# EAGLE design Adafruit-FONA-800-GSM-Breakout (EAGLE 6.4)
COMPANY: ADAFRUIT INDUSTRIES; DRAWN: KTOWN; REV: C
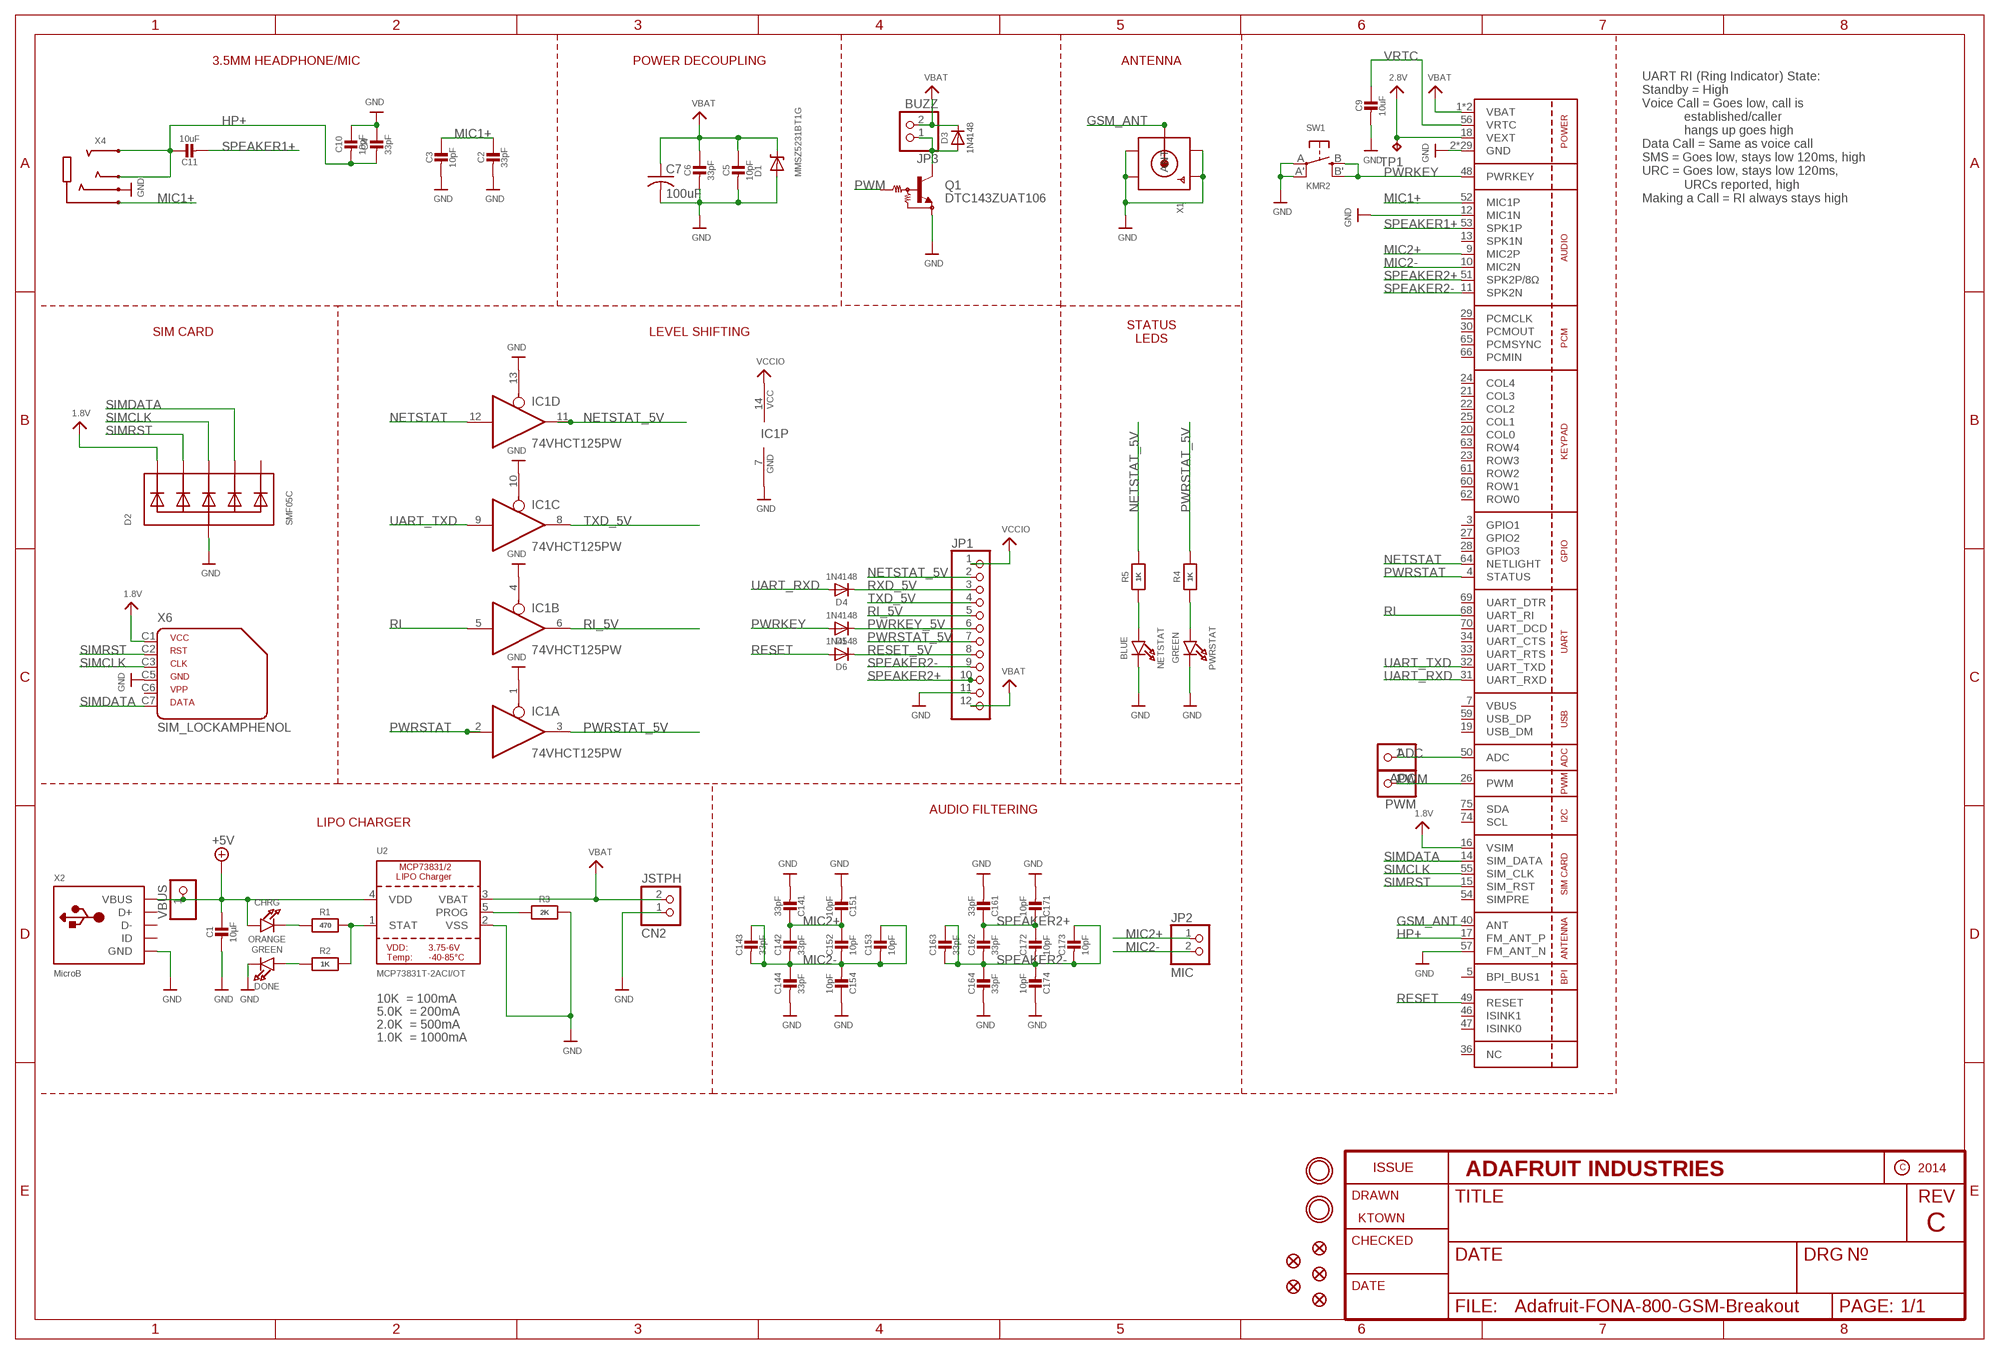
[diagram p0: schematic, sheet 1]

## Parts
ADC  PINHD-1X1CB  [1X01-CLEANBIG]
C1  10µF  CAP_CERAMIC0805-NOOUTLINE  [0805-NO]
C2  33pF  CAP_CERAMIC0805-NOOUTLINE  [0805-NO]
C3  10pF  CAP_CERAMIC0805-NOOUTLINE  [0805-NO]
C4  33pF  CAP_CERAMIC0805-NOOUTLINE  [0805-NO]
C5  10pF  CAP_CERAMIC0805-NOOUTLINE  [0805-NO]
C6  33pF  CAP_CERAMIC0805-NOOUTLINE  [0805-NO]
C7  100uF  C-USC1210  [C1210]
C9  10uF  CAP_CERAMIC0805-NOOUTLINE  [0805-NO]
C10  10pF  CAP_CERAMIC0805-NOOUTLINE  [0805-NO]
C11  10uF  CAP_CERAMIC0805-NOOUTLINE  [0805-NO]
C14  33pF  CAP_4PACK1206  [RESPACK_4X0603]
C15  10pF  CAP_4PACK1206  [RESPACK_4X0603]
C16  33pF  CAP_4PACK1206  [RESPACK_4X0603]
C17  10pF  CAP_4PACK1206  [RESPACK_4X0603]
CHRG  ORANGE  LED0805_NOOUTLINE  [CHIPLED_0805_NOOUTLINE]
CN2  JSTPH  JST_2PIN  [JSTPH2]
D1  MMSZ5231BT1G  DIODE-ZENERSOD123  [SOD-123]
D2  SMF05C  TVSARRAY_5LANE  [SOT363]
D3  1N4148  DIODESOD-323  [SOD-323]
D4  1N4148  DIODESOD-323  [SOD-323]
D5  1N4148  DIODESOD-323  [SOD-323]
D6  1N4148  DIODESOD-323  [SOD-323]
DONE  GREEN  LED0805_NOOUTLINE  [CHIPLED_0805_NOOUTLINE]
FID1  FIDUCIAL""  [FIDUCIAL_1MM]
FID2  FIDUCIAL""  [FIDUCIAL_1MM]
FID3  FIDUCIAL""  [FIDUCIAL_1MM]
FID4  FIDUCIAL""  [FIDUCIAL_1MM]
FID5  FIDUCIAL""  [FIDUCIAL_1MM]
IC1  74VHCT125PW  74ABT125PW  [TSSOP14]
JP1  PINHD-1X12-CB  [1X12-CB]
JP2  MIC  HEADER-1X2ROUND  [1X02_ROUND]
JP3  BUZZ  HEADER-1X2ROUND  [1X02_ROUND]
NETSTAT  BLUE  LED0805_NOOUTLINE  [CHIPLED_0805_NOOUTLINE]
PWM  PINHD-1X1CB  [1X01-CLEANBIG]
PWRSTAT  GREEN  LED0805_NOOUTLINE  [CHIPLED_0805_NOOUTLINE]
Q1  DTC143ZUAT106  MUN2211T1-NPN_DRIVER-SC59-BEC  [SC59-BEC]
R1  470  RESISTOR0805_NOOUTLINE  [0805-NO]
R2  1K  RESISTOR0805_NOOUTLINE  [0805-NO]
R3  2K  RESISTOR0805_NOOUTLINE  [0805-NO]
R4  1K  RESISTOR0805_NOOUTLINE  [0805-NO]
R5  1K  RESISTOR0805_NOOUTLINE  [0805-NO]
SW1  KMR2  SWITCH_TACT_SMT4.6X2.8  [BTN_KMR2_4.6X2.8]
TP1  TPTP11R  [TP11R]
U1  SIM800H/L  GSM_SIM800L  [SIM800L]
U2  MCP73831T-2ACI/OT  MCP73831/2  [SOT23-5]
U$33  MOUNTINGHOLE2.5  [MOUNTINGHOLE_2.5_PLATED]
U$34  MOUNTINGHOLE2.5  [MOUNTINGHOLE_2.5_PLATED]
VBUS  PINHD-1X1CB  [1X01-CLEANBIG]
X1  SMACONNECTOR_EDGE_UFL  [SMA_EDGELAUNCH_UFL]
X2  MicroB  USBMICRO_20329  [4UCONN_20329]
X4  AUDIO_3.5MMJACK_4POL  [4UCONN_18510]
X6  SIM_LOCKAMPHENOL  [C707_10M006_512_2]

## Nets
1.8V: D2.1(C1) U1.16(VSIM) X6.C1
2.8V: TP1.TP U1.18(VEXT)
+5V: C1.1 CHRG.A U2.4(VDD) VBUS.1 X2.VBUS
ADC: ADC.1 U1.50(ADC)
GND: C1.2 C2.2 C3.2 C4.1 C5.2 C6.2 C7.2 C9.2 C10.1 C14.5 C14.8 C15.4 C15.8 C16.5 C16.8 C17.4 C17.8 CN2.1 D1.A D2.2(A) DONE.C IC1.1(A:OE) IC1.4(B:OE) IC1.7(P:GND) IC1.10(C:OE) IC1.13(D:OE) JP1.11 NETSTAT.C PWRSTAT.C Q1.E R3.2 SW1.A'(P1) SW1.A(P) U1.2(GND) U1.6(GND) U1.8(GND) U1.12(MIC1N) U1.35(GND) U1.37(GND) U1.38(GND) U1.39(GND) U1.41(GND) U1.43(GND) U1.44(GND) U1.45(GND) U1.57(FM_ANT_N) U1.58(GND) U1.67(GND) U1.71(GND) U1.72(GND) U1.73(GND) U1.76(GND) U1.77(GND) U1.78(GND) U1.79(GND) U1.80(GND) U1.81(GND) U1.82(GND) U1.83(GND) U1.84(GND) U1.85(GND) U1.86(GND) U1.87(GND) U1.88(GND) U2.2(VSS) X1.GND@1(GND1) X1.GND@2(GND2) X1.GND@3(GND3) X1.GND@4(GND4) X2.BASE@1(GND) X2.BASE@2(GND) X2.GND X2.SPRT@1(GND) X2.SPRT@2(GND) X2.SPRT@3(GND) X2.SPRT@4(GND) X4.4-INNER_SLEEVE(RING1) X6.C5
GSM_ANT: U1.40(ANT) X1.P(ANT)
HP+: C4.2 C10.2 C11.1 U1.17(FM_ANT_P) X4.2-TIP(RING3) X4.3-OUTER_SLEEVE(RING2)
MIC1+: C2.1 C3.1 U1.52(MIC1P) X4.1-GND(TIP)
MIC2+: C14.1 C14.2 C15.1 C15.2 JP2.1 U1.9(MIC2P)
MIC2-: C14.3 C14.4 C14.6 C14.7 C15.3 C15.5 C15.6 C15.7 JP2.2 U1.10(MIC2N)
N$1: CHRG.C R1.1
N$2: R1.2 R2.2 U2.1(STAT)
N$4: PWRSTAT.A R4.1
N$5: R3.1 U2.5(PROG)
N$6: DONE.A R2.1
N$9: NETSTAT.A R5.1
N$16: D3.A JP3.1 Q1.C
NETSTAT: IC1.12(D:I) U1.64(NETLIGHT)
NETSTAT_5V: IC1.11(D:O) JP1.2 R5.2
PWM: PWM.1 Q1.B U1.26(PWM)
PWRKEY: D5.A SW1.B'(S1) SW1.B(S) U1.48(PWRKEY)
PWRKEY_5V: D5.C JP1.6
PWRSTAT: IC1.2(A:I) U1.4(STATUS)
PWRSTAT_5V: IC1.3(A:O) JP1.7 R4.2
RESET: D6.A U1.49(RESET)
RESET_5V: D6.C JP1.8
RI: IC1.5(B:I) U1.68(UART_RI)
RI_5V: IC1.6(B:O) JP1.5
RXD_5V: D4.C JP1.3
SIMCLK: D2.4(C3) U1.55(SIM_CLK) X6.C3
SIMDATA: D2.5(C4) U1.14(SIM_DATA) X6.C7
SIMRST: D2.3(C2) U1.15(SIM_RST) X6.C2
SPEAKER1+: C11.2 U1.53(SPK1P)
SPEAKER2+: C16.1 C16.2 C17.1 C17.2 JP1.10 U1.51(SPK2P/8Ω)
SPEAKER2-: C16.3 C16.4 C16.6 C16.7 C17.3 C17.5 C17.6 C17.7 JP1.9 U1.11(SPK2N)
TXD_5V: IC1.8(C:O) JP1.4
UART_RXD: D4.A U1.31(UART_RXD)
UART_TXD: IC1.9(C:I) U1.32(UART_TXD)
VBAT: C5.1 C6.1 C7.1 CN2.2 D1.C D3.C JP1.12 JP3.2 U1.1(VBAT) U1.42(VBAT) U2.3(VBAT)
VCCIO: IC1.14(P:VCC) JP1.1
VRTC: C9.1 U1.56(VRTC)
Unconnected: D2.6(C5) U1.3(GPIO1) U1.5(BPI_BUS1) U1.13(SPK1N) U1.19(USB_DM) U1.20(COL0) U1.21(COL3) U1.22(COL2) U1.23(ROW3) U1.24(COL4) U1.25(COL1) U1.27(GPIO2) U1.28(GPIO3) U1.29(PCMCLK) U1.30(PCMOUT) U1.33(UART_RTS) U1.34(UART_CTS) U1.36(NC) U1.46(ISINK1) U1.47(ISINK0) U1.54(SIMPRE) U1.59(USB_DP) U1.60(ROW1) U1.61(ROW2) U1.62(ROW0) U1.63(ROW4) U1.65(PCMSYNC) U1.66(PCMIN) U1.69(UART_DTR) U1.70(UART_DCD) U1.74(SCL) U1.75(SDA) X2.D+ X2.D- X2.ID X6.C6

## Notes on the sheet
- 3.5MM HEADPHONE/MIC | POWER DECOUPLING | ANTENNA
- UART RI (Ring Indicator) State:
  Standby = High
  Voice Call = Goes low, call is 
              established/caller 
              hangs up goes high
  Data Call = Same as voice call
  SMS = Goes low, stays low 120ms, high
  URC = Goes low, stays low 120ms,
              URCs reported, high
  Making a Call = RI always stays high
- SIM CARD | LEVEL SHIFTING
- STATUS
  LEDS
- AUDIO FILTERING
- LIPO CHARGER
- 10K  = 100mA
- 5.0K  = 200mA
- 2.0K  = 500mA
- 1.0K  = 1000mA

## Power pins joined to a net without a drawn wire
VBUS: U1.7(VBUS)

## Library data of the parts
ADC PWM VBUS = adafruit:PINHD-1X1: Pin header 1x1 for 0.1" spacing With round pins
C1-C6 C9-C11 = microbuilder:CAP_CERAMIC: Ceramic Capacitors For new designs, use the packages preceded by an '_' character since they are more reliable: The following footprints should be used on most boards: _0402 - Standard footprint for regular board layouts _0603 - Standard footprint for regular board layouts _0805 - Standard footprint for regular board layouts _1206 - Standard footprint for regular board layouts For extremely tight-pitch boards where space is at a premium, the following 'micro-pitch' footprints can be used (smaller pads, no silkscreen outline, etc.): _0402MP - Micro-pitch footprint for very dense/compact boards _0603MP - Micro-pitch footprint for very dense/compact boards _0805MP - Micro-pitch footprint for very dense/compact boards _1206MP - Micro-pitch footprint for very dense/compact boards
C7 = rcl:C-US: CAPACITOR, American symbol
C14-C17 = microbuilder:CAP_4PACK
CHRG DONE NETSTAT PWRSTAT = microbuilder:LED: LED 0603 - 0603 Surface Mount Package 2mA: Green LED - Low Power (3.9mcd, 2ma, 1.7Vf) - Digikey: 475-2709-2-ND Orange LED - Low Power (9.8mcd, 2ma, 1.8Vf) - Digikey: 475-1194-2-ND Red LED - Low Power (5mcd, 2ma, 1.8Vf) - Digikey: 475-1195-2-ND Yellow LED - Low Power (7mcd, 2ma, 1.8Vf) - Digikey: 475-1196-2-ND 5mA: Blue LED - Low Power (17mcd, 5ma, 2.9Vf) - Digikey: LNJ937W8CRACT-ND 0805 - 0805 Surface Mount Package 2mA: Red LED (8.8mcd, 2mA, 1.8Vf, Clear) - Low Power [Digikey: 475-2510-1-ND] Green LED (5mcd, 2mA, 1.8Vf, Clear) - Low Power [Digikey: 475-2730-1-ND] Yellow LED (11.3mcd, 2mA, 1.8Vf, Clear) - Low Power [Digikey: 475-2555-1-ND] 20mA: Red LED (104mcd, 20mA, Diffused) - LS R976 [Digikey: 475-1278-6-ND] Red LED (12mcd, 20mA, 2.0Vf, Clear) - APT2012EC [Digikey: 754-1128-1-ND] Green LED (15mcd, 20mA, 2.2Vf, Clear) - APT2012GC [Digikey: 754-1131-1-ND] Orange LED (160mcd, 20mA, 2.1Vf, Clear) - APT2012SECK [Digikey: 754-1130-1-ND] 1206 - 1206 Surface Mount Package Green LED (26mcd, 20mA, Diffused) - LG N971 [Digikey: 475-1407-6-ND] Red LED (15mcd, 20mA, Diffused) - LH N974 [Digikey: 475-1416-6-ND] Cree - Cree High-Power Surface Mount LEDs XPEBWT-L1-0000-00D50 - White 111lm 350mA 2.9Vf 6200K 110° XTEAWT-00-0000-00000LEE3 - White 114lm 350mA 2.85Vf 5000K 115° Everlight - Everlight 45-21 Series Surface Mount LEDs 45-21/QK2C-B2832AC2CB2/2T - Warm White 2000mcd 20mA 3.25Vf 3050K 120° 45-21/LK2C-B38452C4CB2/2T - Nuetral White 2000mcd 20mA 3.25Vf 4150K 120° 45-21/LK2C-B50634C6CB2/2T - Cold White 2200mcd 20mA 3.25Vf 5650K 120° PLCC2 Reverse Mount LS T77K-J1L2-1-0-2-R18-Z - Red 11.25mcd 2mA 1.8Vf 630nm 120° LO T77K-L1M2-24-Z - Orange 19.6mcd 2mA 1.8Vf 606nm 120° LY T77K-K2M1-26-Z - Yellow 15.7mcd 2mA 1.8Vf 587nm 120°
CN2 = microbuilder:JST_2PIN: JST 2-Pin Right-Angle Connector PH-Series - 4UConnector: 17311 SH-Series - 4UConnector: 07278
D1 = microbuilder:DIODE-ZENER: Zener Diode SMA: 30V 1W Zener Diode, 1.2Vf - Digikey: SMAZ30-FDICT-ND
D2 = microbuilder:TVSARRAY_5LANE: Voltage Transient Suppressor Array SOT363 SMF05C - 100W 5V: Digikey - SMF05CT1GOSCT-ND
D3-D6 = microbuilder:DIODE: Diode SMA Model Volts Amps Type Vf Ir Digikey # Notes SSA34-E3 40V 3A Schottky 480mV @ 3A 200uA @ 40V SSA34-E3/61TGITR-ND CDBA120-G 20V 1A Schottky 500mV @ 1A 500uA @ 20V 641-1014-6-ND REEL MBRA210 10V 2A Schottky 350mV @ 2A 700uA @ 10V MBRA210LT3 SOD-123 Model Volts Amps Type Vf Ir Order # Notes BAT54T1G 30V 200mA Schottky 800mV @ 200mA 2uA @ 25V BAT54T1GOSTR-ND B0530W 30V 500mA Schottky 430mV @ 500mA 130uA @ 30V B0530W-FDICT-ND REEL MBR120 20V 1A Schottky 340mV @ 1A MBR120VLSFT1GOSCT-ND SOD-323 Model Volts Amps Type Vf Ir Order # Notes PMEG2005EJ 20V 500mA Schottky 355mV @ 500mA 568-4110-1-ND ZLLS410 10V 570mA Schottky 380mV @ 570mA ZLLS410CT-ND 1N4148WS 75V 150mA Silicon/Simple 1V 1N4148WSFSCT-ND REEL SOD-523 Model Volts Amps Type Vf Ir Order # Notes BAT54XV2 30V 200mA Schottky 0.8V @ 100mA BAT54XV2CT-ND TB751S 30V 30mA Schottky RB751S-40TE61CT-ND SOT23-R/W (R = Solder Paste/Reflow Ovens, W = Hand-Soldering) Model Volts Amps Type Vf Ir Order # Notes BAT54FILM 40V 300mA Schottky 497-7162-1-ND POWERDI-5 Model Volts Amps Type Vf Ir Order # Notes PDS560 60V 5A Schottky 670mV @ 5A 150uA @ 60V PDS560DICT-ND
FID1-FID5 = microbuilder:FIDUCIAL: Fiducial Alignment Points Various fiducial points for machine vision alignment.; BOM: EXCLUDE
IC1 = 74xx-us:74*125: Quad bus BUFFER, 3-state
JP1 = adafruit2:PINHD-1X12: PIN HEADER
JP2 JP3 = microbuilder:HEADER-1X2: PIN HEADER
Q1 = transistor:*-NPN_DRIVER-: NPN Bias Resistor Transistor
R1-R5 = microbuilder:RESISTOR: Resistors For new designs, use the packages preceded by an '_' character since they are more reliable: The following footprints should be used on most boards: _0402 - Standard footprint for regular board layouts _0603 - Standard footprint for regular board layouts _0805 - Standard footprint for regular board layouts _1206 - Standard footprint for regular board layouts For extremely tight-pitch boards where space is at a premium, the following 'micro-pitch' footprints can be used (smaller pads, no silkscreen outline, etc.): _0402MP - Micro-pitch footprint for very dense/compact boards _0603MP - Micro-pitch footprint for very dense/compact boards _0805MP - Micro-pitch footprint for very dense/compact boards _1206MP - Micro-pitch footprint for very dense/compact boards
SW1 = microbuilder:SWITCH_TACT_SMT: SMT Tact Switches 6x6mm - Digikey: P12940SCT-ND KMR2 (4.6x2.8mm) - Digikey: 401-1426-1-ND EVQ-PQHB55 - Light Touch, 160GF (4.5x4.5mm) - Digikey: P8090SCT-ND KMT0 - KMT021 NGJ LHS (etc.) IP68/Waterproof - Digikey: CKN10289CT-ND
TP1 = testpad:TP: Test pad
U1 = microbuilder:GSM_SIM800L: SIM800K Quad-Band GSM/GPRS Module 850/900/1800/1900 MHz Bluetooth EDR (3.0) FM Band: 76-109MHz (50kHz steps) -40 - 85°C
U2 = microbuilder:MCP73831/2: MCP73831/2 LIPO Charger VDD: 3.75 - 6V Temp -40 - 85°C Programmable Charge Rate: 15-500mA NOTE: STAT is a tri-state logic output on the MCP73831 and an open-drain output on the MCP73832. SOT23-5 with 4.2V output and tri-state logic on STAT = MCP73831T-2ACI/OT
U$33 U$34 = microbuilder:MOUNTINGHOLE: Mounting Hole For #2 screws (0.086"/2.18mm width, 0.094"/2.4mm hole) use 2.5mm; BOM: EXCLUDE
X1 = microbuilder:SMACONNECTOR: SMA Connector 90° DIP SMA Connector, 50 Ohm (4UConnector: 07259)
X2 = microbuilder:USB: USB Connectors USBMINIB - Surface Mount Female Mini-B USB Connector 4UConnector: 06564
X4 = microbuilder:AUDIO_3.5MMJACK_4POL: Footprint courtesy Morten Hjerde (Riftlabs.com) These are normally connected as follows (4-pin 3.5mm 'TRRS'), from left-to right on the schematic symbol above: Tip: Left Audio Outermost Ring: Right Audio Innermost Ring: Common/GND Shell: Mic+
X6 = microbuilder:SIM_LOCK: C707A SIMLOCK® 2.5 mm with wide solder tails Source: Data sheet <http://www.amphenol.info/downloads/C707_10M006_512_2.pdf>; OC_FARNELL: unknown; OC_NEWARK: unknown

## Board
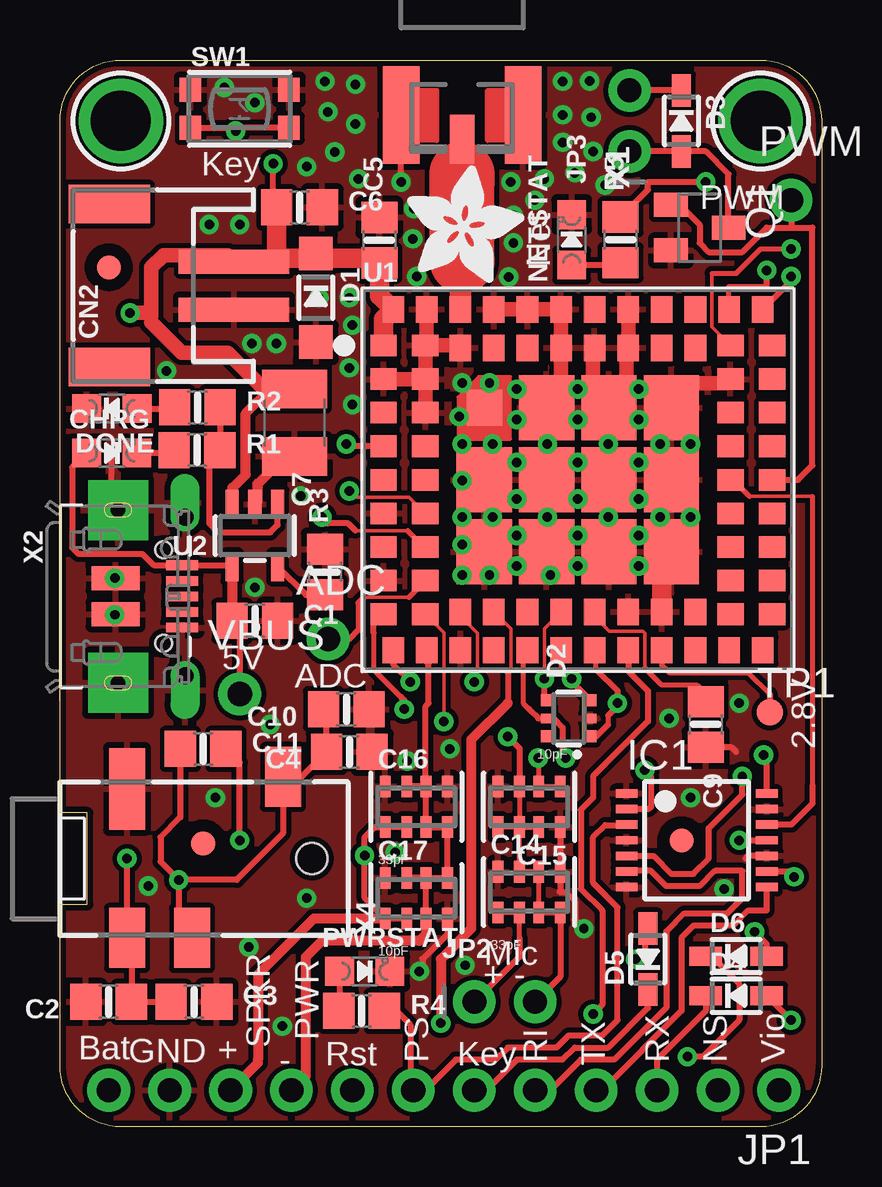
[diagram p1: board, top side]
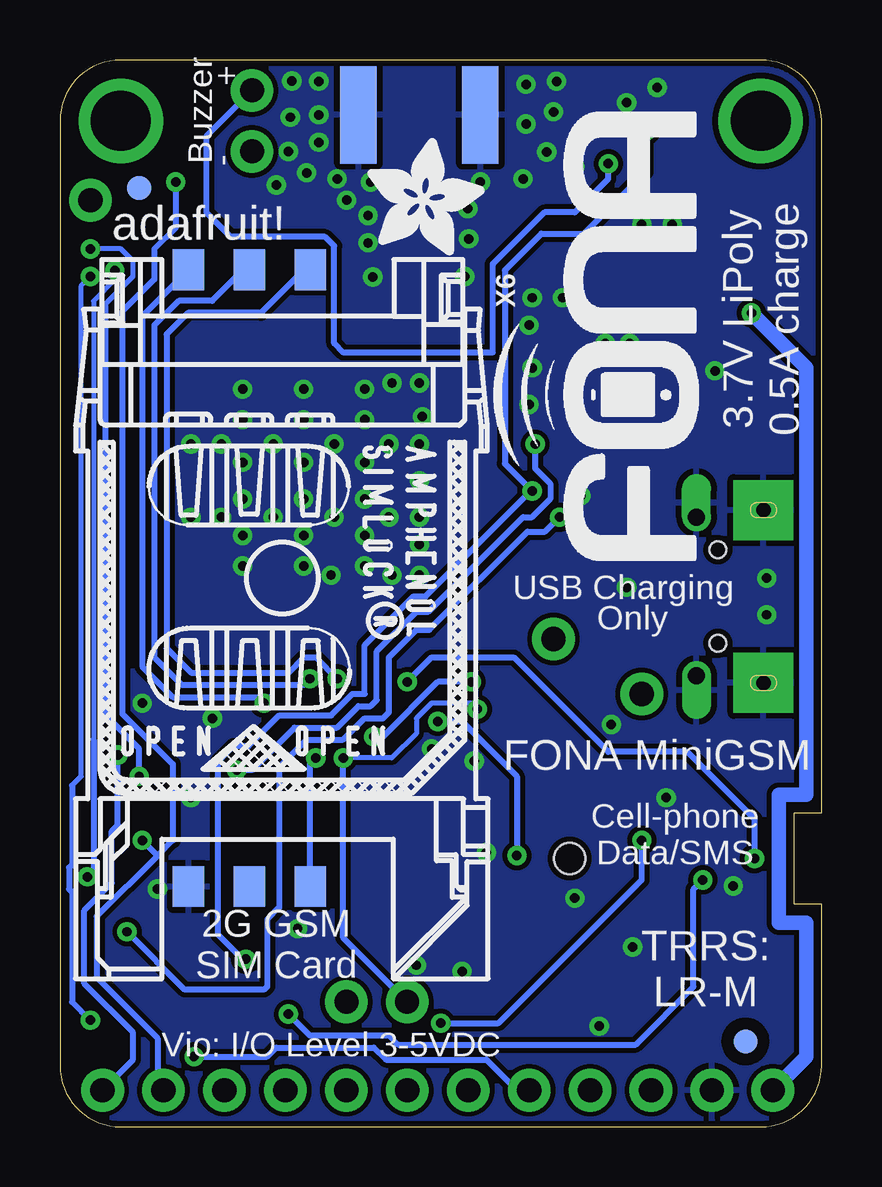
[diagram p2: board, bottom side, seen from below]

Size 31.75 x 44.45 mm. Coordinates in mm from the lower left corner, seen from the top.
Outline: 31.75,41.91 31.75,2.54 arc-90 29.21,0 2.54,0 arc-90 0,2.54 0,9.27 1.14,9.27 1.14,13.08 0,13.08 0,41.91 arc-90 2.54,44.45 29.21,44.45 arc-90 31.75,41.91
Copper layers (1*16): Top 0.035mm / dielectric 1.5mm / Bottom 0.035mm
Design rules "adafruit *": minimum track width 6mil, minimum drill 15.5mil, track to track 8mil, track to pad 6mil, pad to pad 8mil, via to via 8mil, smd to smd 8mil, copper to edge 10mil, drill to drill 8mil, minimum pad ring 10mil, minimum via ring 8mil, stop-mask expansion 2mil, vias tented up to drill 20mil, thermal gap 10mil
tRestrict: area 16.1,22.4 to 16.3,29.2; area 19.8,31.5 to 20.3,31.8; area 22.7,31.5 to 23.1,31.8; area 16.3,22.2 to 24.5,22.4; area 26.8,22.5 to 27.2,30.5; area 17.5,31.5 to 18,31.8; area 16,30.2 to 16.3,30.7

### Footprints (pad centres in the part's own frame; a part is rotated, then mirrored left to right if it is on the bottom)
1X01-CLEANBIG = drill 1.016 pad 1.778: 1 0,0
0805-NO = smd 1.3 x 1.5: 1 -0.95,0; 2 0.95,0
C1210 = smd 1.6 x 2.7: 1 -1.4,0; 2 1.4,0
RESPACK_4X0603 = smd 0.45 x 0.9: 1 -1.3,-0.85; 2 -0.4,-0.85; 3 0.4,-0.85; 4 1.3,-0.85; 5 1.3,0.85; 6 0.4,0.85; 7 -0.4,0.85; 8 -1.3,0.85
CHIPLED_0805_NOOUTLINE = smd 1.2 x 1.2: A 0,-1.05; C 0,1.05
JSTPH2 = smd 1 x 4.6: 1 -1,-3.7; 2 1,-3.7 | smd 1.6 x 3.4: NC1 -3.4,1.5; NC2 3.4,1.5
SOD-123 = smd 1.4 x 1.4: A 1.85,0; C -1.85,0
SOT363 = smd 0.5 x 0.5: 1 -0.75,-0.9; 3 0.75,-0.9; 4 0.75,0.9; 6 -0.75,0.9 | smd 0.4 x 0.5: 2 0,-0.9; 5 0,0.9
SOD-323 = smd 1.35 x 0.8: A 1.27,0; C -1.27,0
FIDUCIAL_1MM = smd 1 x 1: 1 0,0
TSSOP14 = smd 0.35 x 0.9: 1 -1.95,-2.925; 2 -1.3,-2.925; 3 -0.65,-2.925; 4 0,-2.925; 5 0.65,-2.925; 6 1.3,-2.925; 7 1.95,-2.925; 8 1.95,2.925; 9 1.3,2.925; 10 0.65,2.925; 11 0,2.925; 12 -0.65,2.925; 13 -1.3,2.925; 14 -1.95,2.925
1X12-CB = drill 1.016 pad 1.778: 1 -13.97,0; 2 -11.43,0; 3 -8.89,0; 4 -6.35,0; 5 -3.81,0; 6 -1.27,0; 7 1.27,0; 8 3.81,0; 9 6.35,0; 10 8.89,0; 11 11.43,0; 12 13.97,0
1X02_ROUND = drill 1 pad 1.778: 1 -1.27,0; 2 1.27,0
SC59-BEC = smd 1 x 1.4: B -0.95,-1.2; C 0,1.2; E 0.95,-1.2
BTN_KMR2_4.6X2.8 = smd 0.9 x 1: A 2.05,0.8; A' -2.05,0.8; B 2.05,-0.8; B' -2.05,-0.8
TP11R = smd 1.1 x 1.1: TP 0,0
SIM800L = smd 1.1 x 0.9: 1 -8.1,5.6; 2 -8.1,4.2; 3 -8.1,2.8; 4 -8.1,1.4; 5 -8.1,0; 6 -8.1,-1.4; 7 -8.1,-2.8; 8 -8.1,-4.2; 9 -8.1,-5.6; 22 8.1,-5.6; 23 8.1,-4.2; 24 8.1,-2.8; 25 8.1,-1.4; 26 8.1,0; 27 8.1,1.4; 28 8.1,2.8; 29 8.1,4.2; 30 8.1,5.6; 43 -6.36,5.6; 44 -6.36,4.2; 45 -6.36,2.8; 46 -6.36,1.4; 47 -6.36,0; 48 -6.36,-1.4; 49 -6.36,-2.8; 50 -6.36,-4.2; 51 -6.36,-5.6; 60 6.36,-5.6; 61 6.36,-4.2; 62 6.36,-2.8; 63 6.36,-1.4; 64 6.36,0; 65 6.36,1.4; 66 6.36,2.8; 67 6.36,4.2; 68 6.36,5.6 | smd 0.9 x 1.1: 10 -7.7,-7.1; 11 -6.3,-7.1; 12 -4.9,-7.1; 13 -3.5,-7.1; 14 -2.1,-7.1; 15 -0.7,-7.1; 16 0.7,-7.1; 17 2.1,-7.1; 18 3.5,-7.1; 19 4.9,-7.1; 20 6.3,-7.1; 21 7.7,-7.1; 31 7.7,7.1; 32 6.3,7.1; 33 4.9,7.1; 34 3.5,7.1; 35 2.1,7.1; 36 0.7,7.1; 37 -0.7,7.1; 38 -2.1,7.1; 39 -3.5,7.1; 40 -4.9,7.1; 41 -6.3,7.1; 42 -7.7,7.1; 52 -4.9,-5.5; 53 -3.5,-5.5; 54 -2.1,-5.5; 55 -0.7,-5.5; 56 0.7,-5.5; 57 2.1,-5.5; 58 3.5,-5.5; 59 4.9,-5.5; 69 4.9,5.5; 70 3.5,5.5; 71 2.1,5.5; 72 0.7,5.5; 73 -0.7,5.5; 74 -2.1,5.5; 75 -3.5,5.5; 76 -4.9,5.5 | smd 1.5 x 1.5: 77 -3.9,3 | smd 2.3 x 2.7: 78 -3.9,0; 79 -3.9,-3; 80 -1.3,-3; 81 1.3,-3; 82 3.9,-3; 83 3.9,0; 84 3.9,3; 85 1.3,3; 86 -1.3,3; 87 -1.3,0; 88 1.3,0
SOT23-5 = smd 0.55 x 1.2: 1 -0.95,-1.3; 2 0,-1.3; 3 0.95,-1.3; 4 0.95,1.3; 5 -0.95,1.3
MOUNTINGHOLE_2.5_PLATED = drill 2.5 pad 3.2: P$1 0,0
SMA_EDGELAUNCH_UFL = smd 4.064 x 1.524: GND@1 2.032,-2.54; GND@2 2.032,2.54 | smd 4.064 x 1.524 bottom: GND@3 2.032,2.54; GND@4 2.032,-2.54 | smd 2.032 x 1.016: P 3.048,0
4UCONN_20329 = smd 1 x 2: BASE@1 -0.75,-2; BASE@2 0.75,-2 | smd 0.4 x 1.35: D+ 0,0.775; D- -0.65,0.775; GND 1.3,0.775; ID 0.65,0.775; VBUS -1.3,0.775 | drill 0.7 offset: SPRT@1 -3.3,0.9; SPRT@2 3.3,0.9 | drill 0.6 pad 2.5 square: SPRT@3 -3.6,-1.9; SPRT@4 3.6,-1.9 | hole 0.7: -1.95,0; 1.95,0
4UCONN_18510 = smd 1.5 x 2.5: 1-GND 2.8,-3.3; 2-TIP 9.3,3.4; 3-OUTER_SLEEVE 5.5,-3.3 | smd 1.5 x 3.4: 4-INNER_SLEEVE 2.8,2.9 | hole 1.3: 10.5,0
C707_10M006_512_2 = smd 1.7 x 1.3: C1 -12.85,-3.915; C2 -12.85,-1.375; C3 -12.85,1.165; C5 12.85,-3.915; C6 12.85,-1.375; C7 12.85,1.165

### Placement (x,y rotation side)
ADC  11.18,20.32 0 top
C1  8.13,21.08 0 top
C2  2.03,5.21 180 top
C3  5.59,5.21 0 top
C4  12.06,15.62 180 top
C5  13.32,36.94 90 top
C6  9.99,38.31 0 top
C7  9.78,29.34 270 top
C9  26.92,16.76 270 top
C10  11.94,17.4 180 top
C11  5.97,15.75 0 top
C14  19.56,9.78 0 top
C15  19.56,13.34 180 top
C16  14.86,13.34 0 top
C17  14.86,9.53 0 top
CHRG  2.16,28.08 270 top
CN2  3.56,35.05 90 top
D1  10.67,34.54 270 top
D2  21.21,17.02 90 top
D3  25.91,41.91 270 top
D4  28.19,5.46 0 top
D5  24.51,6.99 90 top
D6  28.19,7.11 0 top
DONE  2.17,29.93 90 top
FID1  5.97,11.81 0 top
FID2  2.03,35.81 0 top
FID3  25.91,11.94 0 top
FID4  28.45,39.12 0 bottom
FID5  3.17,3.56 0 bottom
IC1  26.54,11.94 270 top
JP1  16,1.52 180 top
JP2  18.54,5.21 0 top
JP3  23.75,41.91 90 top
NETSTAT  21.34,36.96 0 top
PWM  30.48,38.61 0 top
PWRSTAT  12.7,6.48 270 top
Q1  26.67,37.47 270 top
R1  5.71,28.19 0 top
R2  5.73,29.97 0 top
R3  11.05,23.11 90 top
R4  12.57,4.83 0 top
R5  23.37,36.96 90 top
SW1  7.49,42.42 0 top
TP1  29.59,17.27 0 top
U1  21.59,26.96 0 top
U2  8.13,24.64 180 top
U$10  [ADAFRUIT_5MM]  14.48,35.18 0 top
U$26  [FONA_LOGO]  4.95,23.11 90 bottom
U$33  29.21,41.91 90 top
U$34  2.54,41.91 90 top
U$36  [ADAFRUIT_5MM]  18.92,36.32 0 bottom
VBUS  7.49,18.03 0 top
X1  16.76,44.2 270 top
X2  4.32,22.1 270 top
X4  0,11.18 0 top
X6  22.48,22.86 270 bottom

### Tracks (layer width: path | path; a pad name or v marks a point on that pad's centre or on a via)
1.8V  (via drill 0.39)
  Top 0.203: 22.86,16.76 22.86,17.14 | 22.35,19.05 22.35,19.79 U1.16
  Top 0.254: 22.35,19.05 23.24,18.16 v23.24,17.65 23.24,17.53 22.86,17.14 | 22.86,16.76 22.36,16.27 D2.1
  Bottom 0.254: X6.C1 28.32,33.78 28.32,19.18 27.05,17.91 22.99,17.91 v23.24,17.65
2.8V
  Top 0.203: U1.18 25.09,19.23 25.4,18.92 28.7,18.92 29.59,18.03
  Top 0.254: 29.59,18.03 TP1.TP
+5V
  Top 0.254: CHRG.A 0.51,27.48 0.51,24.13 0.76,23.88 3.43,23.88 3.91,23.4 X2.VBUS 7.12,23.4 U2.4 | C1.1 7.49,20.77 VBUS.1
  Top 0.406: U2.4 C1.1
ADC
  Top 0.152: 14.55,22.06 12.68,22.06
  Top 0.203: 14.55,22.06 15.23,22.74 U1.50
  Top 0.254: 12.68,22.06 12.45,21.83 12.45,20.7 12.06,20.32 ADC.1
GND  (via drill 0.39)
  Top 0.254: v19.05,30.73 20.29,30.73 U1.86 | v21.59,30.73 22.89,30.73 | v24.13,30.73 22.89,30.73 | 22.89,30.73 U1.85 | v20.32,28.45 20.32,27.69 v19.05,27.69 | v21.59,27.69 v24.13,27.69 25.15,27.69 | v16.76,25.4 v16.76,28.45 18.03,27.18 v18.03,25.4 | v18.03,25.4 18.03,26.16 v19.05,26.16 | v20.32,25.4 20.32,26.16 v21.59,26.16 | v18.03,25.4 18.03,24.64 v19.05,24.64 v21.59,24.64 v24.13,24.64 25.15,24.64 | v19.05,23.37 v21.59,23.37 v24.13,23.37 25.15,23.37 | 25.15,26.16 v24.13,26.16 | 26.16,30.99 26.16,29.96 U1.84 | X2.SPRT@3 2.16,25.7 2.16,28.07 | C15.8 C14.5 20.86,9.81 20.83,9.78 21.08,9.78 21.46,9.4 21.46,8.64 v21.84,8.26 | 28.19,15.62 28,15.81 C9.2 | C16.5 16.2,14.22 | 15.11,6.35 v14.99,6.48 15.11,6.6 15.11,6.99 16.16,8.03 C17.4 | v14.22,39.37 14.22,40.39 | IC1.10 28.69,11.29 28.57,11.18
  Top 0.406: U2.2 8.26,26.07 8.26,26.8 9.39,27.94 C7.2
  Top 0.61: U1.86 20.89,30.56 U1.73 U1.37 U1.38 U1.39 | U1.76 16.59,32.56 U1.43 | U1.43 15.29,32.62 U1.41 | U1.43 U1.44 | U1.44 U1.2 | U1.44 U1.45 | U1.67 27.78,30.99 26.16,30.99 | U1.35 U1.71 23.62,32.39 23.62,30.99 | U1.72 22.23,32.39 22.23,30.99
  Top 0.813: U1.58 25.09,23.56 U1.82
  other vias: 18.03,28.45 19.05,29.46 21.59,29.46 24.13,29.46 25.02,28.45 26.29,28.45 26.29,25.4 25.02,25.4 22.86,28.45 22.86,25.4 16.76,26.92 16.76,24.26 16.76,22.99 17.91,22.99 20.45,22.99 17.91,30.99 16.64,29.59 16.76,30.99 8.13,22.48 18.71,35.41 19.8,38.61 22.08,43.58 22.14,42.06 20.95,42.16 11.05,43.56 12.32,43.43 11.18,42.29 11.46,40.61 14.75,38.25 14.71,37 14.88,35.43 18.91,37.97 18.91,36.83 20.95,41.02 20.95,43.56 2.29,22.86 2.29,21.34 8,32.64 18.8,39.37 3.68,10.03 10.79,34.54 10.29,40.01 12.06,31.62 12.19,33.4 9.02,32.64 12.19,30.1 12.06,34.54 6.22,37.59 7.49,37.59 13.97,11.43 10.29,9.53 6.48,13.72 8.76,16.76 7.87,7.49 16.89,6.73 9.27,4.19 25.4,17.02 28.32,17.65 6.86,43.31 12.32,41.78 22.23,40.64 21.46,39.75 22.73,39.24 20.19,39.5 12.45,39.5 4.45,31.5 8.13,42.67 27.69,9.91 14.48,15.24 16.26,15.75 26.29,13.72 10.03,26.29
  pour Top: 0,44.32 -0.13,-0.25 31.75,-0.25 31.88,44.32
  pour Bottom: 0,44.32 -0.13,0 31.75,0 31.88,44.32
GSM_ANT
  Top 0.254: 16.76,37.1 16.77,37.1 | X1.P 16.77,40.51 | 16.69,36.02 16.77,35.95 16.77,35.94
  Top 0.305: 16.77,36.07 16.77,35.94 16.77,35.82
  Top 0.406: 16.77,40.51 16.77,39.37
  Top 0.9: U1.40 16.69,36.02
  Top 2.7: 16.77,36.07 16.77,37.1 16.77,39.37 16.77,39.68 16.76,39.69
HP+  (via drill 0.39)
  Top 0.254: U1.17 23.69,18.98 24.51,18.16 24.51,16.89 22.23,14.61 22.23,13.72 21.72,13.21 21.72,9.91 22.61,9.02 22.61,5.08 v22.23,4.7 | v4.95,10.29 4.95,8.42 X4.3-OUTER_SLEEVE | C11.1 5.02,12.89 4.19,12.06 4.19,11.05 v4.95,10.29 | C10.2 11.12,17.27 C4.2 10.07,14.58 X4.2-TIP 9.3,12.22 7.37,10.29 v4.95,10.29
  Bottom 0.254: v4.95,10.29 5.33,9.91 5.33,5.84 7.75,3.43 17.65,3.43 18.03,3.81 21.34,3.81 v22.23,4.7
MIC1+  (via drill 0.39)
  Top 0.152: 16.69,21.28 17.4,20.57 17.4,18.92 17.27,18.8 v17.27,18.54
  Top 0.254: U1.52 16.69,21.28 | C3.1 C2.1 2.98,7.95 2.87,7.95 X4.1-GND v2.8,11.17 v2.79,11.18
  Bottom 0.254: v17.27,18.54 16.26,19.56 12.83,19.56 8.89,15.62 5.59,15.62 2.79,12.83 v2.79,11.18
MIC2+  (via drill 0.39)
  Top 0.203: 13.08,20.57 13.08,19.05 14.22,17.91 | v19.94,15.37 19.96,15.35 C15.2 C15.1 | 19.16,7.86 C14.2 C14.1
  Top 0.254: 13.08,20.57 13.08,20.95 U1.9 | 19.16,7.86 19.16,7.09 JP2.1 | 14.22,17.91 14.35,17.78 v14.35,17.4
  Bottom 0.203: v14.35,17.4 14.61,17.65 16.26,17.65 16.89,17.02 16.89,16.38 17.91,15.37 v19.94,15.37
  Bottom 0.254: JP2.1 19.94,7.87 v19.94,15.37
MIC2-  (via drill 0.39)
  Top 0.203: C15.3 C15.6 | C15.6 C15.5 | C15.6 C15.7 | C15.6 C14.7 C14.6 C14.3 C14.4
  Top 0.254: v18.67,16.26 19.16,15.77 C15.3 | C14.4 20.86,6.25 JP2.2 | U1.10 13.89,19.26 v14.61,18.54
  Bottom 0.254: v14.61,18.54 16,18.54 18.29,16.26 v18.67,16.26
N$1
  Top 0.254: CHRG.C 4.65,28.08 R1.1
N$2
  Top 0.254: U2.1 9.08,25.08 8.76,24.77 6.6,24.77 6.22,25.15 6.22,27.75 R1.2 6.68,28.21 R2.2
N$4
  Top 0.254: PWRSTAT.A 11.65,4.85 R4.1
N$5
  Top 0.254: R3.1 10.25,22.16 U2.5
N$6
  Top 0.254: DONE.A 4.74,29.93 R2.1
N$9
  Top 0.254: R5.1 23.27,35.91 NETSTAT.A
N$16
  Top 0.254: JP3.1 D3.A 26.92,40.64 27.87,39.69 Q1.C
NETSTAT
  Top 0.152: 28.74,26.26 31.37,26.26
  Top 0.203: 31.37,26.26 31.37,14.22 | 28.74,26.26 28.05,26.96 U1.64
  Top 0.254: 31.37,14.22 31.37,13.46 30.5,12.59 IC1.12
NETSTAT_5V  (via drill 0.39)
  Top 0.254: JP1.2 27.43,1.78 | R5.2 24.51,39.05 24.51,39.37 v26.92,39.37 | v28.32,11.94 IC1.11
  Bottom 0.254: v26.92,39.37 26.92,37.47 27.81,36.58 27.81,35.31 29.15,33.97 29.15,17.21 27.05,15.11 27.05,11.94 27.69,11.3 | JP1.2 27.43,1.78 27.69,2.03 27.69,3.68 30.23,6.22 30.23,8.76 27.69,11.3 | 27.69,11.3 v28.32,11.94
PWM
  Top 0.254: U1.26 30.77,26.96 31.37,27.56 31.37,37.47 30.48,37.47 | 30.48,37.47 29.46,37.47 28.45,36.45 27.05,36.45 26.67,36.83 26.67,37.59 25.85,38.41 Q1.B | PWM.1 30.48,37.47
PWRKEY  (via drill 0.39)
  Top 0.152: v12.06,26.49 12.12,26.49 12.37,26.24 14.55,26.24 U1.48
  Top 0.254: D5.A 24.38,8.13 24.38,7.37 v24,6.99 | SW1.B' 7.2,41.62 v7.33,41.49 7.46,41.62 SW1.B
  Bottom 0.254: v7.33,41.49 7.33,39.79 9.91,37.21 11.68,37.21 13.21,35.69 13.21,27.64 v12.06,26.49 12.06,26.54 16.51,22.1 17.02,22.1 19.05,20.07 19.05,18.03 19.56,18.03 20.45,17.14 22.61,17.14 23.88,15.88 24.51,15.88 25.15,15.24 25.15,8 24.13,6.99 v24,6.99
PWRKEY_5V
  Top 0.254: JP1.6 17.78,1.52 19.05,2.79 20.95,2.79 21.46,3.3 22.86,3.3 24.51,4.95 D5.C
PWRSTAT  (via drill 0.39)
  Top 0.254: U1.4 12.03,28.36 v11.94,28.45 | v24.38,14.86 24.64,14.61 24.64,13.34 24.54,13.24 IC1.2
  Bottom 0.254: v11.94,28.45 11.94,27.43 11.3,26.8 11.3,26.16 12.06,25.4 12.45,25.4 16.38,21.46 16.89,21.46 18.54,19.81 18.54,17.78 18.8,17.53 19.3,17.53 20.19,16.64 21.97,16.64 23.75,14.86 v24.38,14.86
PWRSTAT_5V
  Top 0.254: IC1.3 23.6,12.57 22.73,12.57 22.23,12.06 22.23,10.16 23.24,9.14 23.24,4.45 22.61,3.81 21.21,3.81 20.7,3.3 18.67,3.3 18.16,2.79 16.51,2.79 15.24,1.52 JP1.7 14.61,1.65 14.61,4.25 14.03,4.83 R4.2
RESET  (via drill 0.39)
  Top 0.152: 14.49,24.84 12.32,24.84
  Top 0.203: 14.49,24.84 15.18,24.16 U1.49
  Top 0.254: 12.32,24.84 12.01,25.15 11.18,25.15 v10.92,25.4 | D6.A 29.46,7.62 v28.96,8.13
  Bottom 0.254: v10.92,25.4 11.52,24.8 12.26,24.8 16.36,20.7 16.89,20.7 18.03,19.56 18.03,17.27 18.29,17.02 19.05,17.02 19.94,16.13 21.46,16.13 22.61,14.99 22.61,9.14 23.11,8.64 23.11,5.84 23.24,5.71 26.54,5.71 v28.96,8.13
RESET_5V  (via drill 0.39)
  Top 0.254: v26.16,2.92 26.8,2.92 28.32,4.45 28.32,5.97 27.18,7.11 D6.C
  Bottom 0.254: JP1.8 12.7,1.52 13.97,2.79 18.16,2.79 18.67,3.3 22.73,3.3 23.11,2.92 v26.16,2.92
RI  (via drill 0.39)
  Top 0.152: U1.68 27.18,33.33 27.18,35.56
  Top 0.203: 27.18,35.56 28.19,35.56 29.21,36.58 v30.48,36.58
  Top 0.254: IC1.5 24.75,11.29 25.5,10.54 26.42,10.54 27.05,11.18 27.05,12.45 28.45,13.84 v28.45,14.61
  Bottom 0.203: 29.84,34.29 28.7,35.43 28.7,36.07 29.21,36.58 v30.48,36.58
  Bottom 0.254: v28.45,14.61 28.45,15.75 29.84,17.14 29.84,34.29
RI_5V
  Top 0.254: JP1.5 20.45,1.52 21.72,2.79 23.11,2.79 25.27,4.95 25.27,8.13 26.04,8.89 27.81,8.89 28.45,9.53 28.45,10.67 27.3,10.67 26.67,10.03 25.27,10.03 24.64,10.67 23.65,10.67 IC1.6
RXD_5V
  Top 0.254: D4.C 26.92,4.83 24.89,2.79 JP1.3
SIMCLK  (via drill 0.39)
  Top 0.152: U1.55 20.19,20.76 v20.19,18.67
  Top 0.254: 20.19,19.05 v20.19,18.67 20.19,17.88 D2.4
  Bottom 0.254: X6.C3 21.57,35.71 23.37,33.91 26.42,33.91 27.3,33.02 27.3,19.94 26.29,18.92 22.23,18.92 21.59,19.56 21.08,19.56 v20.19,18.67
SIMDATA  (via drill 0.39)
  Top 0.203: U1.14 19.3,19.67 19.3,17.65 19.56,17.4
  Top 0.254: 19.56,17.4 19.94,17.02 D2.5 20.57,17.02 20.95,16.64 20.95,15.49 v21.08,15.37
  Bottom 0.254: X6.C7 21.31,15.13 v21.08,15.37
SIMRST  (via drill 0.39)
  Top 0.203: U1.15 20.89,19.11 21.14,18.86
  Top 0.254: 21.14,18.86 v21.34,18.67 21.34,18.54 D2.3
  Bottom 0.254: X6.C2 24.11,35.71 25.4,34.42 26.8,34.42 27.81,33.4 27.81,19.56 26.67,18.41 21.59,18.41 v21.34,18.67
SPEAKER1+  (via drill 0.39)
  Top 0.152: U1.53 18.8,20.75 18.8,19.05 18.67,18.92
  Top 0.254: 18.67,18.92 18.67,17.65 | 7.37,15.75 C11.2 7.49,15.17 v7.49,11.94
  Top 0.406: 18.67,17.65 17.14,16.13 17.14,8.26 15.88,6.99 v15.88,4.32
  Bottom 0.254: v15.88,4.32 13.46,4.32 7.49,10.29 v7.49,11.94
SPEAKER2+  (via drill 0.39)
  Top 0.152: U1.51 16,20.58 v16,16.89
  Top 0.254: C17.2 C17.1 12.7,9.53 v12.7,11.3 12.7,12.06 13.12,12.48 C16.1 C16.2 | 8.26,3.37 8.26,2.79 8.26,2.67
  Top 0.406: 8.26,2.67 JP1.10 | 8.26,2.79 8.26,6.35 10.58,8.68 C17.1
  Bottom 0.254: v16,16.89 14.99,16.89 12.7,14.61 v12.7,11.3
SPEAKER2-
  Top 0.254: C17.3 C17.6 | C17.6 C17.7 | C17.6 C17.5 C16.4 C16.3 C16.6 | C16.6 C16.7 | U1.11 15.29,19.38 15.37,19.3 15.37,17.65 15.24,17.53 15.24,14.2 C16.6
  Top 0.406: JP1.9 10.25,2.12 10.25,7.07 10.92,7.75 14.99,7.75 15.26,8.02 C17.3
TXD_5V
  Top 0.254: IC1.8 29.47,9.02 28.71,9.02 28.07,8.38 26.42,8.38 25.91,7.87 25.91,4.83 22.61,1.52 JP1.4
UART_RXD  (via drill 0.39)
  Top 0.203: 29.34,34.1 U1.31
  Top 0.254: v30.48,4.45 D4.A | 29.34,34.1 30.48,35.25 v30.48,35.43
  Bottom 0.203: 31.24,14.22 30.86,14.61 30.86,35.05 v30.48,35.43
  Bottom 0.254: 31.24,14.22 31.24,10.92 31.37,10.79 31.37,9.91 31.24,9.78 31.24,5.21 v30.48,4.45
UART_TXD  (via drill 0.39)
  Top 0.203: U1.32 27.89,35 | 29.46,34.92 29.46,35
  Top 0.254: IC1.9 30.38,10.64 v30.61,10.41 | 27.89,35 29.46,35 v29.46,35.69
  Bottom 0.203: v29.46,35.69 29.46,35.31 30.35,34.42 30.35,16.13
  Bottom 0.254: 30.35,16.13 30.35,10.67 v30.61,10.41
VBAT  (via drill 0.39)
  Top 0.254: D3.C JP3.2 | C6.1 8.89,38.45 v8.89,40.13
  Top 0.406: 3.81,33.53 3.81,33.78 | 6.99,36.32 CN2.2 | 8.51,30.74 8.76,30.74 7.75,29.72 7.75,27.18 7.21,26.64 7.18,26.64 U2.3
  Top 0.61: 3.81,33.53 5.08,32.26 6.99,32.26 8.51,30.74 | 6.99,36.32 4.32,36.32 3.81,35.81 3.81,33.78 3.68,33.91 v2.92,33.91 | 8.76,30.74 C7.1
  Top 0.813: U1.1 13.49,33.66 U1.42 13.32,34.63 C5.1 13.12,36.2 10.87,36.2 | C6.1 9.04,36.2 | 9.04,36.2 9.04,36.05 CN2.2 | D1.C 10.67,36.2 9.04,36.2
  Top 1.016: D1.C 10.87,36.2
  Bottom 0.254: v8.89,40.13 8.89,39.5 10.29,38.1 11.56,38.1 13.72,35.94 13.72,32.26 19.94,32.26 20.32,32.64 20.32,36.7 20.7,37.08 24.64,37.08 25.63,38.08 25.63,41.3 JP3.2
  Bottom 0.61: JP1.12 0.64,2.92 0.64,8.51 1.78,8.51 1.78,13.84 0.64,13.84 0.64,31.62 v2.92,33.91
VCCIO  (via drill 0.39)
  Top 0.254: v29.33,15.49 v29.34,15.49 29.47,15.36 IC1.14
  Bottom 0.254: JP1.1 28.7,2.79 28.7,3.94 30.73,5.97 30.73,9.02 29.59,10.16 29.59,12.32 29.34,12.57 v29.34,15.49
VRTC
  Top 0.152: 22.29,21.27 22.91,20.65 24.31,20.65 24.38,20.57 24.38,19.11
  Top 0.203: U1.56 22.29,21.27 | 26.92,17.91 C9.1 26.92,18.03 26.54,18.41 25.08,18.41 24.38,19.11

### Text on the board
tPlace: Key | PWM | Net | 5V | ADC | 2.8V | Mic | PWR | + | - | Bat | GND | Key | + | SPKR | Rst | PS | RI | TX | RX | NS | Vio | -
bPlace: Buzzer | + | - | adafruit! | 3.7V LiPoly / 0.5A charge | USB Charging | Only | FONA MiniGSM | Cell-phone / Data/SMS | 2G GSM / SIM Card | TRRS: / LR-M | Vio: I/O Level 3-5VDC